# Altium project Test PCB Rev 1.PrjPcb
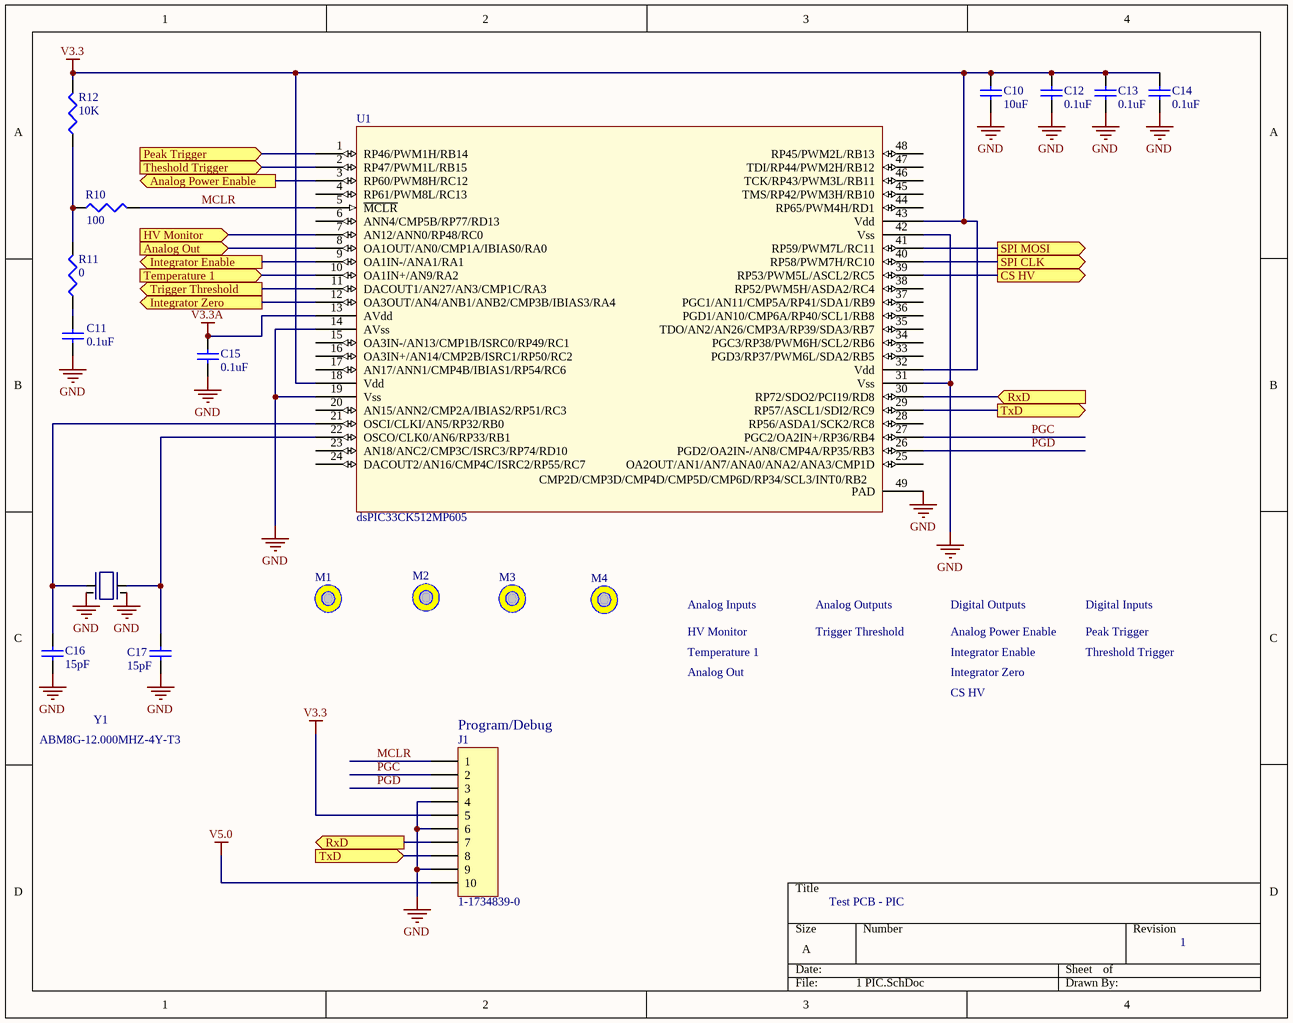
[diagram p0: 1 PIC.SchDoc]
6 sheets, 158 parts. Net scope: flat (ports and power ports of the same name join across sheets).
Board file: Test PCB Rev 1.PcbDoc
Sheets:
  1 PIC.SchDoc
  2 Analog.SchDoc
  3 Bias Supply.SchDoc
  4 USB.SchDoc
  5 SiPM.SchDoc
  6 Power.SchDoc

## Sheet 1 PIC.SchDoc
size A

### Parts
C10  10uF  [C0805]
C11  0.1uF  [C0402]
C12  0.1uF  [C0402]
C13  0.1uF  [C0402]
C14  0.1uF  [C0402]
C15  0.1uF  [C0402]
C16  15pF  [C0603]
C17  15pF  [C0603]
J1  1-1734839-0  [1-1734839-0]
M1  Mounting Hole  [Mounting Hole 0-80]  (value not drawn)
M2  Mounting Hole  [Mounting Hole 0-80]  (value not drawn)
M3  Mounting Hole  [Mounting Hole 0-80]  (value not drawn)
M4  Mounting Hole  [Mounting Hole 0-80]  (value not drawn)
R10  100  [R0603]
R11  0  [R0603]
R12  10K  [R0603]
U1  dsPIC33CK512MP605  [QFN40P600X600X90_HS-49N]
Y1  ABM8G-12.000MHZ-4Y-T3  [7M Series XTAL]

### Ports
Analog Out (in), Analog Power Enable (out), CS HV (out), HV Monitor (in), Integrator Enable (out), Integrator Zero (out), Peak Trigger (in), RxD (in), RxD (out), SPI CLK (out), SPI MOSI (out), Temperature 1 (in), Theshold Trigger (in), Trigger Threshold (out), TxD (in), TxD (out)

### Nets
GND: C10.1 C11.1 C12.1 C13.1 C14.1 C15.1 C16.1 C17.1 J1.4 J1.6 J1.9 U1.14(AVss) U1.19(Vss) U1.31(Vss) U1.42(Vss) U1.49(PAD) Y1.2 Y1.4
V3.3: C10.2 C12.2 C13.2 C14.2 J1.5 R12.2 U1.18(Vdd) U1.32(Vdd) U1.43(Vdd)
V3.3A: C15.2 U1.13(AVdd)
V5.0: J1.10
Analog Out: U1.8(OA1OUT/AN0/CMP1A/IBIAS0/RA0) ; port Analog Out
MCLR: J1.1 R10.2 U1.5(~{MCLR})
PGC: J1.2 U1.27(PGC2/OA2IN+/RP36/RB4)
PGD: J1.3 U1.26(PGD2/OA2IN-/AN8/CMP4A/RP35/RB3)
NetC11_2: C11.2 R11.1
NetC16_2: C16.2 U1.21(OSCI/CLKI/AN5/RP32/RB0) Y1.1
NetC17_2: C17.2 U1.22(OSCO/CLK0/AN6/RP33/RB1) Y1.3
NetJ1_7: J1.7 U1.30(RP72/SDO2/PCI19/RD8) ; port RxD
NetJ1_8: J1.8 U1.29(RP57/ASCL1/SDI2/RC9) ; port TxD
NetR10_1: R10.1 R11.2 R12.1
NetR80_2: U1.11(DACOUT1/AN27/AN3/CMP1C/RA3) ; port Trigger Threshold
NetR82_1: U1.2(RP47/PWM1L/RB15) ; port Theshold Trigger
NetR94_1: U1.1(RP46/PWM1H/RB14) ; port Peak Trigger
NetU1_3: U1.3(RP60/PWM8H/RC12) ; port Analog Power Enable
NetU1_7: U1.7(AN12/ANN0/RP48/RC0) ; port HV Monitor
NetU1_9: U1.9(OA1IN-/ANA1/RA1) ; port Integrator Enable
NetU1_10: U1.10(OA1IN+/AN9/RA2) ; port Temperature 1
NetU1_12: U1.12(OA3OUT/AN4/ANB1/ANB2/CMP3B/IBIAS3/RA4) ; port Integrator Zero
NetU1_39: U1.39(RP53/PWM5L/ASCL2/RC5) ; port CS HV
NetU1_40: U1.40(RP58/PWM7H/RC10) ; port SPI CLK
NetU1_41: U1.41(RP59/PWM7L/RC11) ; port SPI MOSI

Not connected (* = marked no-connect by the designer): U1 4(RP61/PWM8L/RC13) 6(ANN4/CMP5B/RP77/RD13) 15(OA3IN-/AN13/CMP1B/ISRC0/RP49/RC1) 16(OA3IN+/AN14/CMP2B/ISRC1/RP50/RC2) 17(AN17/ANN1/CMP4B/IBIAS1/RP54/RC6) 20(AN15/ANN2/CMP2A/IBIAS2/RP51/RC3) 23(AN18/ANC2/CMP3C/ISRC3/RP74/RD10) 24(DACOUT2/AN16/CMP4C/ISRC2/RP55/RC7) 25(OA2OUT/AN1/AN7/ANA0/ANA2/ANA3/CMP1D) 28(RP56/ASDA1/SCK2/RC8) 33(PGD3/RP37/PWM6L/SDA2/RB5) 34(PGC3/RP38/PWM6H/SCL2/RB6) 35(TDO/AN2/AN26/CMP3A/RP39/SDA3/RB7) 36(PGD1/AN10/CMP6A/RP40/SCL1/RB8) 37(PGC1/AN11/CMP5A/RP41/SDA1/RB9) 38(RP52/PWM5H/ASDA2/RC4) 44(RP65/PWM4H/RD1) 45(TMS/RP42/PWM3H/RB10) 46(TCK/RP43/PWM3L/RB11) 47(TDI/RP44/PWM2H/RB12) 48(RP45/PWM2L/RB13)

### Notes on the sheet
- Analog Inputs
- HV Monitor
- Analog Outputs
- Trigger Threshold
- Digital Outputs
- Analog Power Enable
- Digital Inputs
- Peak Trigger
- Temperature 1
- Analog Out
- Integrator Enable
- Integrator Zero
- CS HV
- Threshold Trigger
- (near J1) Program/Debug
- Test PCB - PIC
- 1
- (in symbol dsPIC33CK512MP605) CMP2D/CMP3D/CMP4D/CMP5D/CMP6D/RP34/SCL3/INT0/RB2

### Library data of the parts
C10-C17 = Cap SM: Capacitor, SM; Published: 8-Jun-2000; LatestRevisionDate: 29-May-2009; LatestRevisionNote: IPC-7351 Footprint Added.; PackageReference: C1206; Publisher: Altium Limited; PackageDescription: Chip Capacitor
  C10: Value: 10uF
  C11-C15: Value: 0.1uF
  C16 C17: Value: 15pF
J1 = Header 10: LatestRevisionDate: 17-Jul-2002; LatestRevisionNote: Re-released for DXP Platform.; Publisher: Altium Limited; Part Number: 1-1734839-0
R10-R12 = Res SM: Resistor; Published: 8-Jun-2000; LatestRevisionDate: 29-May-2009; LatestRevisionNote: IPC-7351 Footprint Added.; PackageReference: J1-0603; Publisher: Altium Limited; PackageDescription: Chip Resistor
  R10: Value: 100
  R11: Value: 0
  R12: Value: 10K
U1 = dsPIC33CK512MP605: Microcontroller
Y1 = Crystal 4 Terminal

## Sheet 2 Analog.SchDoc
size A
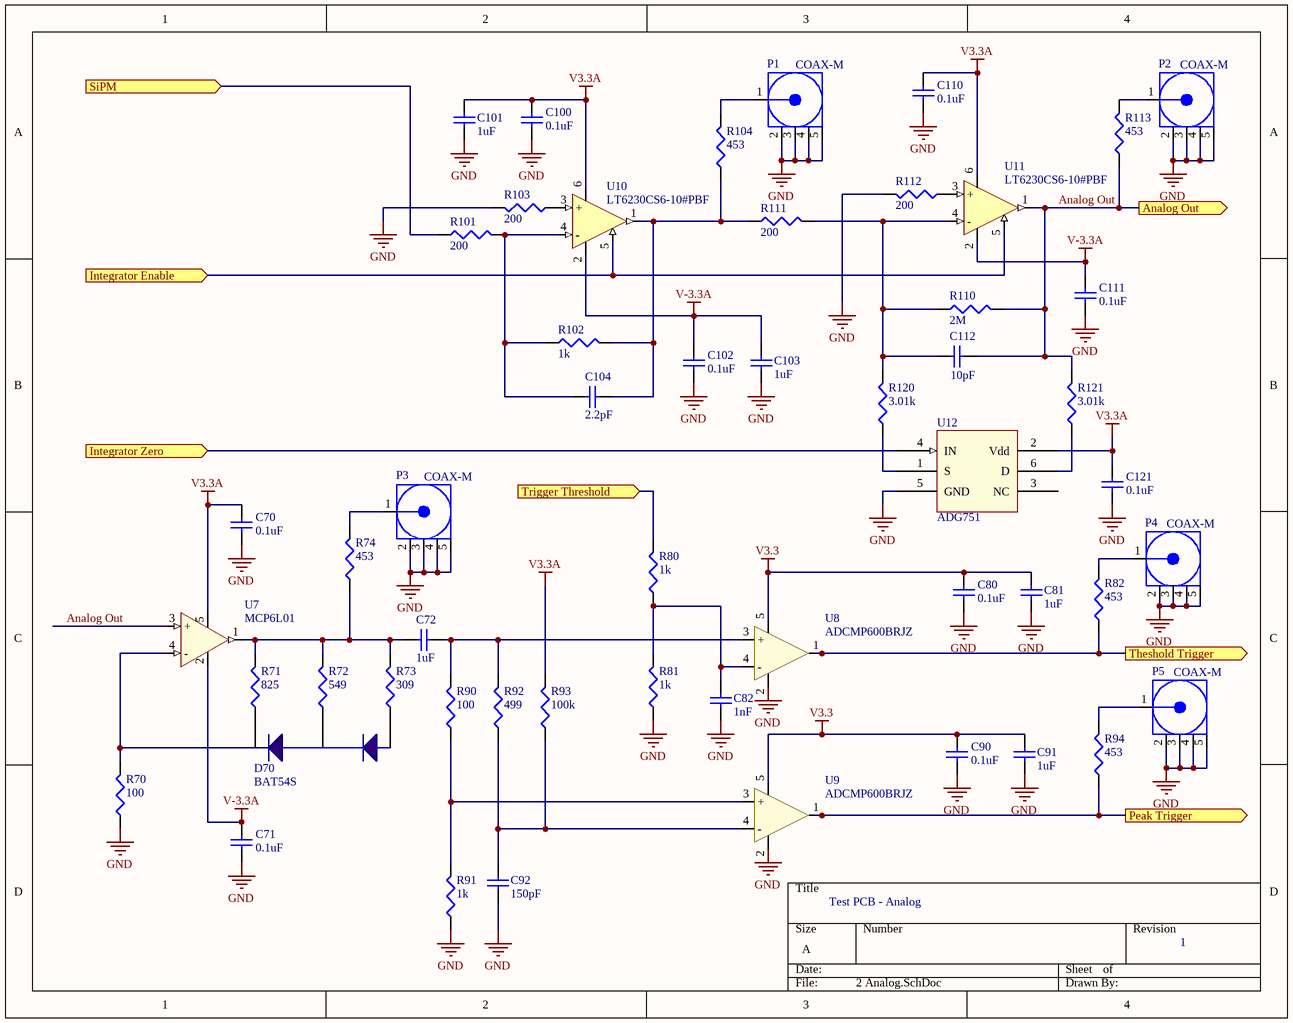
[diagram p1: 2 Analog.SchDoc]

### Parts
C70  0.1uF  [C0402]
C71  0.1uF  [C0402]
C72  1uF  [C0603]
C80  0.1uF  [C0402]
C81  1uF  [C0603]
C82  1nF  [C0603]
C90  0.1uF  [C0402]
C91  1uF  [C0603]
C92  150pF  [C0603]
C100  0.1uF  [C0402]
C101  1uF  [C0603]
C102  0.1uF  [C0402]
C103  1uF  [C0603]
C104  2.2pF  [C0603]
C110  0.1uF  [C0402]
C111  0.1uF  [C0402]
C112  10pF  [C0603]
C121  0.1uF  [C0402]
D70  BAT54S  [SOT323-3]
P1  COAX-M  [MMCX/SM]
P2  COAX-M  [MMCX/SM]
P3  COAX-M  [MMCX/SM]
P4  COAX-M  [MMCX/SM]
P5  COAX-M  [MMCX/SM]
R70  100  [R0603]
R71  825  [R0603]
R72  549  [R0603]
R73  309  [R0603]
R74  453  [R0603]
R80  1k  [R0603]
R81  1k  [R0603]
R82  453  [R0603]
R90  100  [R0603]
R91  1k  [R0603]
R92  499  [R0603]
R93  100k  [R0603]
R94  453  [R0603]
R101  200  [R0603]
R102  1k  [R0603]
R103  200  [R0603]
R104  453  [R0603]
R110  2M  [R0603]
R111  200  [R0603]
R112  200  [R0603]
R113  453  [R0603]
R120  3.01k  [R0603]
R121  3.01k  [R0603]
U7  MCP6L01  [SOT23-5]
U8  ADCMP600BRJZ  [SC70-5]
U9  ADCMP600BRJZ  [SC70-5]
U10  LT6230CS6-10#PBF  [SOT23-6]
U11  LT6230CS6-10#PBF  [SOT23-6]
U12  ADG751  [SOT23-6]

### Ports
Analog Out (out), Integrator Enable (in), Integrator Zero (in), Peak Trigger (out), SiPM (in), Theshold Trigger (out), Trigger Threshold (in)

### Nets
GND: C70.1 C71.1 C80.1 C81.1 C82.1 C90.1 C91.1 C92.1 C100.1 C101.1 C102.1 C103.1 C110.1 C111.1 C121.1 P1.2(GND) P1.3(GND) P1.4(GND) P1.5(GND) P2.2(GND) P2.3(GND) P2.4(GND) P2.5(GND) P3.2(GND) P3.3(GND) P3.4(GND) P3.5(GND) P4.2(GND) P4.3(GND) P4.4(GND) P4.5(GND) P5.2(GND) P5.3(GND) P5.4(GND) P5.5(GND) R70.1 R81.1 R91.1 R103.2 R112.2 U8.2(GND) U9.2(GND) U12.5(GND)
V3.3: C80.2 C81.2 C90.2 C91.2 U8.5(Vcc) U9.5(Vcc)
V3.3A: C70.2 C100.2 C101.2 C110.2 C121.2 R93.2 U7.5(Vdd) U10.6(V+) U11.6(V+) U12.2(Vdd)
V-3.3A: C71.2 C102.2 C103.2 C111.2 U7.2(GND) U10.2(V-) U11.2(V-)
Analog Out: C112.2 R110.2 R113.1 R121.2 U7.3(+) U11.1(Output) ; port Analog Out
NetC72_1: C72.1 R90.2 R92.2 U8.3(+)
NetC72_2: C72.2 R71.2 R72.2 R73.2 R74.1 U7.1(Vout)
NetC82_2: C82.2 R80.1 R81.2 U8.4(-)
NetC92_2: C92.2 R92.1 R93.1 U9.4(-)
NetC104_1: C104.1 R101.2 R102.1 U10.4(-)
NetC104_2: C104.2 R102.2 R104.1 R111.1 U10.1(Output)
NetC112_1: C112.1 R110.1 R111.2 R120.2 U11.4(-)
NetD70_1: D70.1 R73.1
NetD70_2: D70.2 R71.1
NetD70_3: D70.3 R72.1
NetP1_1: P1.1(Signal) R104.2
NetP2_1: P2.1(Signal) R113.2
NetP3_1: P3.1(Signal) R74.2
NetP4_1: P4.1(Signal) R82.2
NetP5_1: P5.1(Signal) R94.2
NetR1_1: R101.1 ; port SiPM
NetR70_2: R70.2 U7.4(-)
NetR80_2: R80.2 ; port Trigger Threshold
NetR82_1: R82.1 U8.1(Q) ; port Theshold Trigger
NetR90_1: R90.1 R91.2 U9.3(+)
NetR94_1: R94.1 U9.1(Q) ; port Peak Trigger
NetR103_1: R103.1 U10.3(+)
NetR112_1: R112.1 U11.3(+)
NetR120_1: R120.1 U12.1(S)
NetR121_1: R121.1 U12.6(D)
NetU1_9: U10.5(/S/D) U11.5(/S/D) ; port Integrator Enable
NetU1_12: U12.4(IN) ; port Integrator Zero

Not connected (* = marked no-connect by the designer): U12 3(NC)

### Notes on the sheet
- Test PCB - Analog
- 1

### Library data of the parts
C70-C72 C80-C82 C90-C92 C100-C104 C110-C112 C121 = Cap SM: Capacitor, SM; Published: 8-Jun-2000; LatestRevisionDate: 29-May-2009; LatestRevisionNote: IPC-7351 Footprint Added.; PackageReference: C1206; Publisher: Altium Limited; PackageDescription: Chip Capacitor
  C70 C71 C80 C90 C100 C102 C110 C111 C121: Value: 0.1uF
  C72 C81 C91 C101 C103: Value: 1uF
  C82: Value: 1nF
  C92: Value: 150pF
  C104: Value: 2.2pF
  C112: Value: 10pF
P1-P5 = COAX-M: RF Coaxial PCB Connector, MMCX; Thru-Hole, Vertical Mount Plug,  50 Ohm Impedance; PackageDocument: Rev. A, 16-Jun-1997; PCB_Layout: Complies with manufacturer's recommendation.; DrillSize: Corresponds to nominal value.; Published: 15-Jul-2004; LatestRevisionDate: 15-Jul-2004; LatestRevisionNote: Component Replaced.; DatasheetDocument: 30-May-2003; PackageReference: 908-21103; Publisher: Altium Limited; ComponentLink1Description: Manufacturer Link; ComponentLink1URL: http://www.amphenolrf.com/
R70-R74 R80-R82 R90-R94 R101-R104 R110-R113 R120 R121 = Res SM: Resistor; Published: 8-Jun-2000; LatestRevisionDate: 29-May-2009; LatestRevisionNote: IPC-7351 Footprint Added.; PackageReference: J1-0603; Publisher: Altium Limited; PackageDescription: Chip Resistor
  R70 R90: Value: 100
  R71: Value: 825
  R72: Value: 549
  R73: Value: 309
  R74 R82 R94 R104 R113: Value: 453
  R80 R81 R91 R102: Value: 1k
  R92: Value: 499
  R93: Value: 100k
  R101 R103 R111 R112: Value: 200
  R110: Value: 2M
  R120 R121: Value: 3.01k
U7 = MCP6L01: Op amp RRIO
U8 U9 = ADCMP600: Comparator
U10 U11 = LMH6639: Op amp, RRO

## Sheet 3 Bias Supply.SchDoc
size A
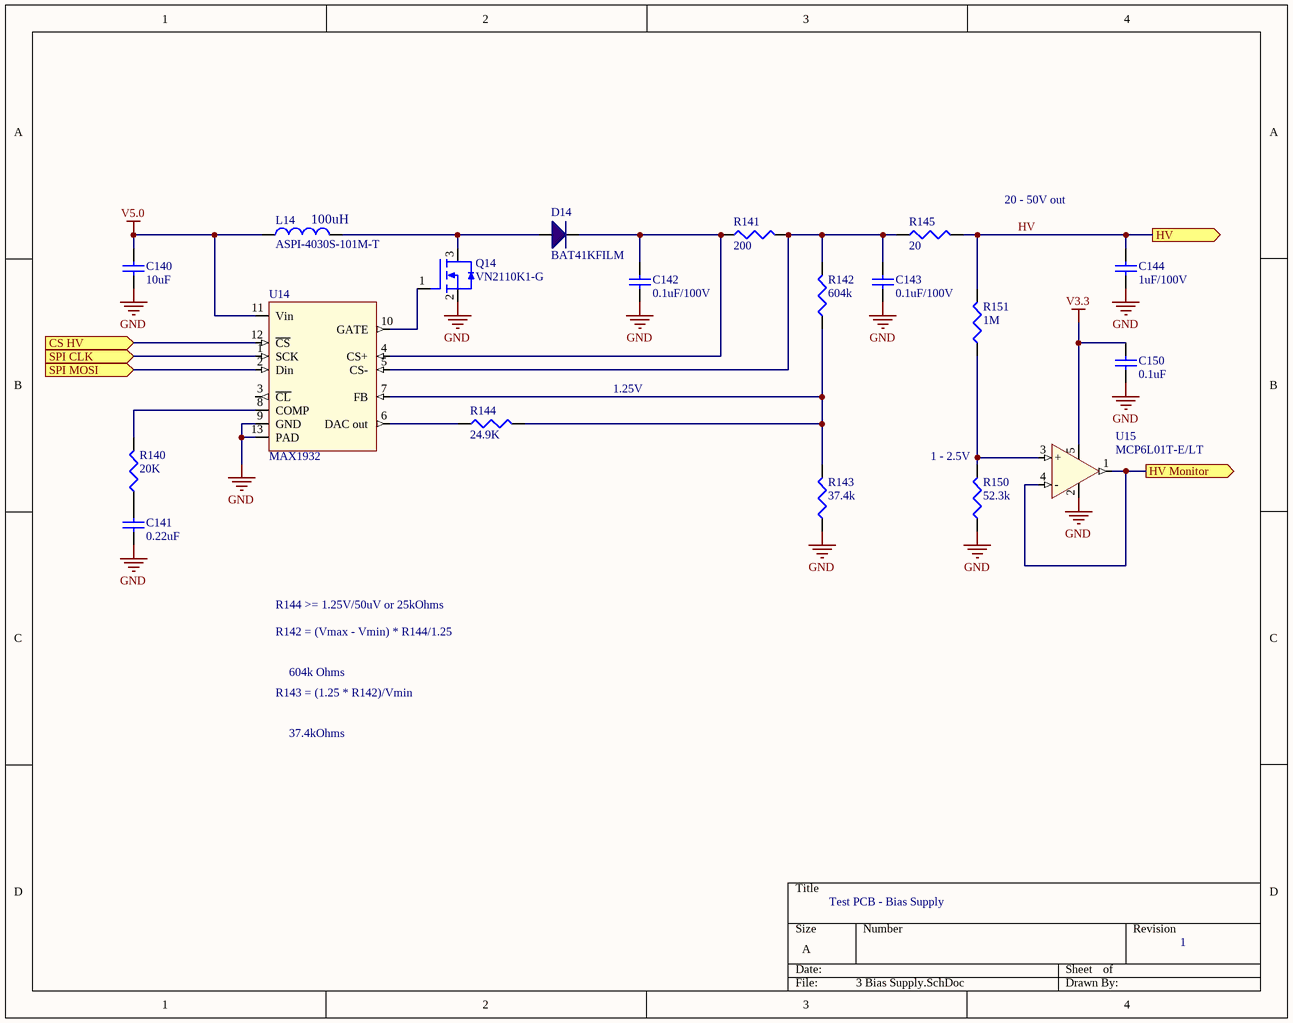
[diagram p2: 3 Bias Supply.SchDoc]

### Parts
C140  10uF  [C0805]
C141  0.22uF  [C0603]
C142  0.1uF/100V  [C0603]
C143  0.1uF/100V  [C0603]
C144  1uF/100V  [C0805]
C150  0.1uF  [C0402]
D14  BAT41KFILM  [SOD523]
L14  ASPI-4030S-101M-T  Inductance: 100uH  [L_4018]
Q14  VN2110K1-G  [SOT23-3]
R140  20K  [R0603]
R141  200  [R0603]
R142  604k  [R0603]
R143  37.4k  [R0603]
R144  24.9K  [R0603]
R145  20  [R0603]
R150  52.3k  [R0603]
R151  1M  [R0603]
U14  MAX1932  [QFN127P600-12N]
U15  MCP6L01T-E/LT  [SOT23-5]

### Ports
CS HV (in), HV (out), HV Monitor (out), SPI CLK (in), SPI MOSI (in)

### Nets
GND: C140.1 C141.1 C142.1 C143.1 C144.1 C150.1 Q14.2 R143.1 R150.1 U14.9(GND) U14.13(PAD) U15.2(GND)
V3.3: C150.2 U15.5(Vdd)
V5.0: C140.2 L14.1 U14.11(Vin)
HV: C144.2 R145.2 R151.2 ; port HV
NetC141_2: C141.2 R140.1
NetC142_2: C142.2 D14.2(K) R141.1 U14.4(CS+)
NetC143_2: C143.2 R141.2 R142.2 R145.1 U14.5(CS-)
NetD14_1: D14.1(A) L14.2 Q14.3
NetQ14_1: Q14.1 U14.10(GATE)
NetR140_2: R140.2 U14.8(COMP)
NetR142_1: R142.1 R143.2 R144.2 U14.7(FB)
NetR144_1: R144.1 U14.6(DAC_out)
NetR150_2: R150.2 R151.1 U15.3(+)
NetU1_7: U15.1(Vout) U15.4(-) ; port HV Monitor
NetU1_39: U14.12(~{CS}) ; port CS HV
NetU1_40: U14.1(SCK) ; port SPI CLK
NetU1_41: U14.2(Din) ; port SPI MOSI

Not connected (* = marked no-connect by the designer): U14 3(~{CL})

### Notes on the sheet
- 20 - 50V out
- 1.25V
- (near R150) 1 - 2.5V
- R144 >= 1.25V/50uV or 25kOhms
- R142 = (Vmax - Vmin) * R144/1.25
- R143 = (1.25 * R142)/Vmin
- 604k Ohms
- 37.4kOhms
- Test PCB - Bias Supply
- 1

### Library data of the parts
C140-C144 C150 = Cap SM: Capacitor, SM; Published: 8-Jun-2000; LatestRevisionDate: 29-May-2009; LatestRevisionNote: IPC-7351 Footprint Added.; PackageReference: C1206; Publisher: Altium Limited; PackageDescription: Chip Capacitor
  C140: Value: 10uF
  C141: Value: 0.22uF
  C142 C143: Value: 0.1uF/100V
  C144: Value: 1uF/100V
  C150: Value: 0.1uF
D14 = BAT41KFILM: Schottky diode; Part Number: BAT41KFILM
L14 = Inductor: 47uH inductor; Part Number: ASPI-4030S-101M-T
Q14 = N FET: Part Number: DMN10H220L-7
R140-R145 R150 R151 = Res SM: Resistor; Published: 8-Jun-2000; LatestRevisionDate: 29-May-2009; LatestRevisionNote: IPC-7351 Footprint Added.; PackageReference: J1-0603; Publisher: Altium Limited; PackageDescription: Chip Resistor
  R140: Value: 20K
  R141: Value: 200
  R142: Value: 604k
  R143: Value: 37.4k
  R144: Value: 24.9K
  R145: Value: 20
  R150: Value: 52.3k
  R151: Value: 1M
U14 = MAX1932: APD bias supply; Part Number: MAX1932
U15 = MCP6L01: Op amp RRIO; Part Number: MCP6L01T-E/LT

## Sheet 4 USB.SchDoc
size A
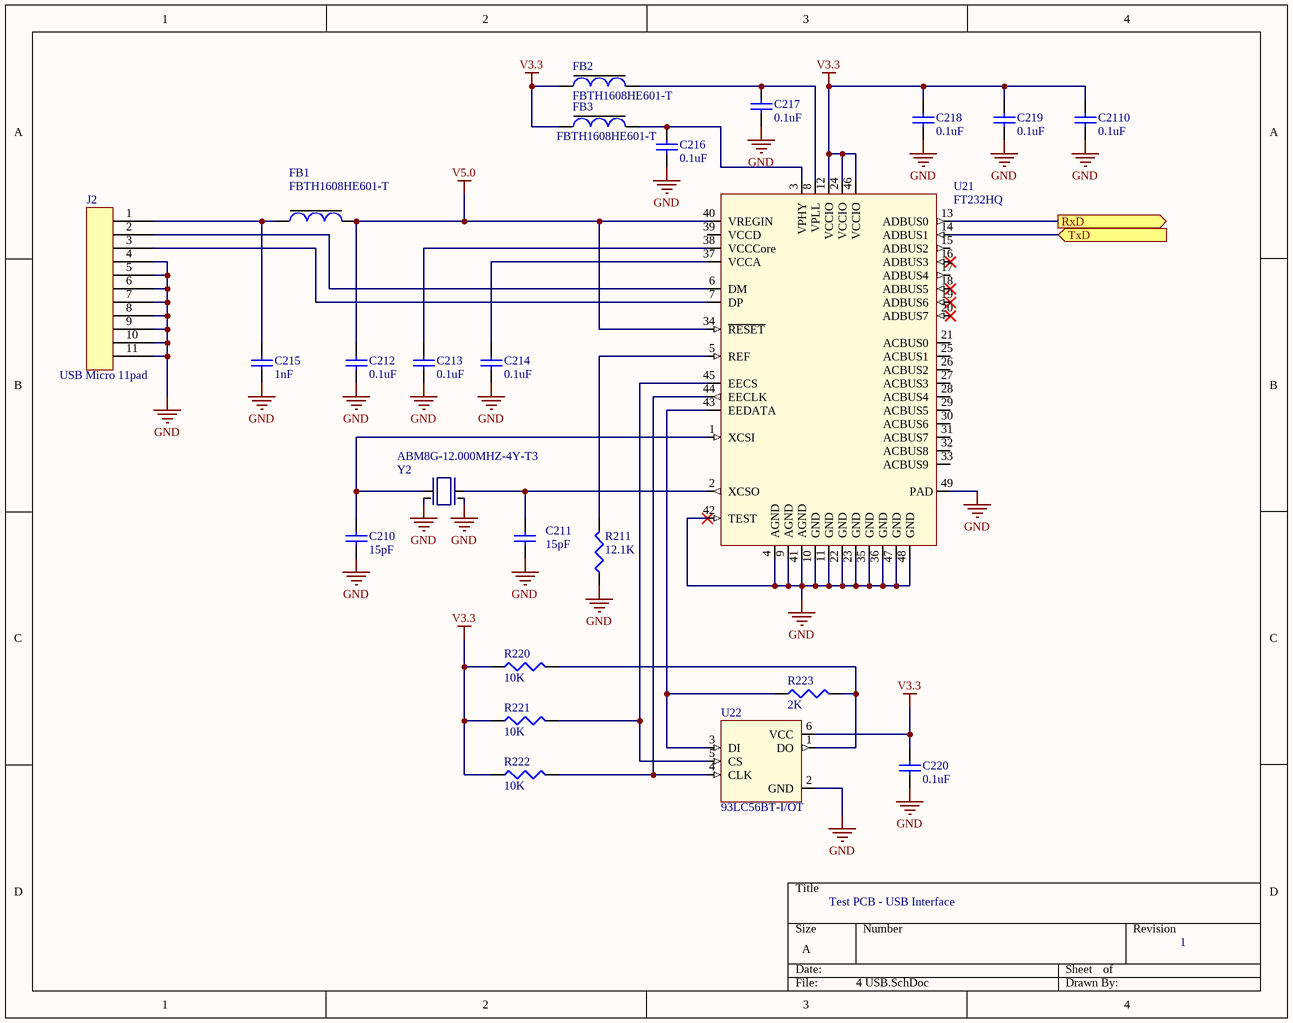
[diagram p3: 4 USB.SchDoc]

### Parts
C210  15pF  [C0603]
C211  15pF  [C0603]
C212  0.1uF  [C0402]
C213  0.1uF  [C0402]
C214  0.1uF  [C0402]
C215  1nF  [C0603]
C216  0.1uF  [C0402]
C217  0.1uF  [C0402]
C218  0.1uF  [C0402]
C219  0.1uF  [C0402]
C220  0.1uF  [C0402]
C2110  0.1uF  [C0402]
FB1  FBTH1608HE601-T  [MPZ1608]
FB2  FBTH1608HE601-T  [MPZ1608]
FB3  FBTH1608HE601-T  [MPZ1608]
J2  USB Micro 11pad  [FCI 10118193]
R211  12.1K  [R0603]
R220  10K  [R0603]
R221  10K  [R0603]
R222  10K  [R0603]
R223  2K  [R0603]
U21  FT232HQ  [QFN50P800X800X100_HS-49N]
U22  93LC56BT-I/OT  [SOT23-6]
Y2  ABM8G-12.000MHZ-4Y-T3  [7M Series XTAL]

### Ports
RxD (out), TxD (in)

### Nets
GND: C210.1 C211.1 C212.1 C213.1 C214.1 C215.1 C216.1 C217.1 C218.1 C219.1 C220.1 C2110.1 J2.4 J2.5 J2.6 J2.7 J2.8 J2.9 J2.10 J2.11 R211.1 U21.4(AGND) U21.9(AGND) U21.10(GND) U21.11(GND) U21.22(GND) U21.23(GND) U21.35(GND) U21.36(GND) U21.41(AGND) U21.42(TEST) U21.47(GND) U21.48(GND) U21.49(PAD) U22.2(GND) Y2.2 Y2.4
V3.3: C218.2 C219.2 C220.2 C2110.2 FB2.1 FB3.1 R220.1 R221.1 R222.1 U21.12(VCCIO) U21.24(VCCIO) U21.46(VCCIO) U22.6(VCC)
V5.0: C212.2 FB1.2 U21.34(~{RESET}) U21.40(VREGIN)
NetC210_2: C210.2 U21.1(XCSI) Y2.1
NetC211_2: C211.2 U21.2(XCSO) Y2.3
NetC213_2: C213.2 U21.38(VCCCore)
NetC214_2: C214.2 U21.37(VCCA)
NetC215_2: C215.2 FB1.1 J2.1
NetC216_2: C216.2 FB3.2 U21.3(VPHY)
NetC217_2: C217.2 FB2.2 U21.8(VPLL)
NetJ1_7: U21.13(ADBUS0) ; port RxD
NetJ1_8: U21.14(ADBUS1) ; port TxD
NetJ2_2: J2.2 U21.6(DM)
NetJ2_3: J2.3 U21.7(DP)
NetR211_2: R211.2 U21.5(REF)
NetR220_2: R220.2 R223.2 U22.1(DO)
NetR221_2: R221.2 U21.45(EECS) U22.5(CS)
NetR222_2: R222.2 U21.44(EECLK) U22.4(CLK)
NetR223_1: R223.1 U21.43(EEDATA) U22.3(DI)

Not connected (* = marked no-connect by the designer): U21 15(ADBUS2) 16(ADBUS3)* 17(ADBUS4) 18(ADBUS5)* 19(ADBUS6)* 20(ADBUS7)* 21(ACBUS0) 25(ACBUS1) 26(ACBUS2) 27(ACBUS3) 28(ACBUS4) 29(ACBUS5) 30(ACBUS6) 31(ACBUS7) 32(ACBUS8) 33(ACBUS9) 39(VCCD)

### Notes on the sheet
- Test PCB - USB Interface
- 1

### Library data of the parts
C210-C220 C2110 = Cap SM: Capacitor, SM; Published: 8-Jun-2000; LatestRevisionDate: 29-May-2009; LatestRevisionNote: IPC-7351 Footprint Added.; PackageReference: C1206; Publisher: Altium Limited; PackageDescription: Chip Capacitor
  C210 C211: Value: 15pF
  C212-C214 C216-C220 C2110: Value: 0.1uF
  C215: Value: 1nF
FB1-FB3 = Ferrite Bead
R211 R220-R223 = Res SM: Resistor; Published: 8-Jun-2000; LatestRevisionDate: 29-May-2009; LatestRevisionNote: IPC-7351 Footprint Added.; PackageReference: J1-0603; Publisher: Altium Limited; PackageDescription: Chip Resistor
  R211: Value: 12.1K
  R220-R222: Value: 10K
  R223: Value: 2K
U21 = FT232HQ: USB interface
Y2 = Crystal 4 Terminal

## Sheet 5 SiPM.SchDoc
size A
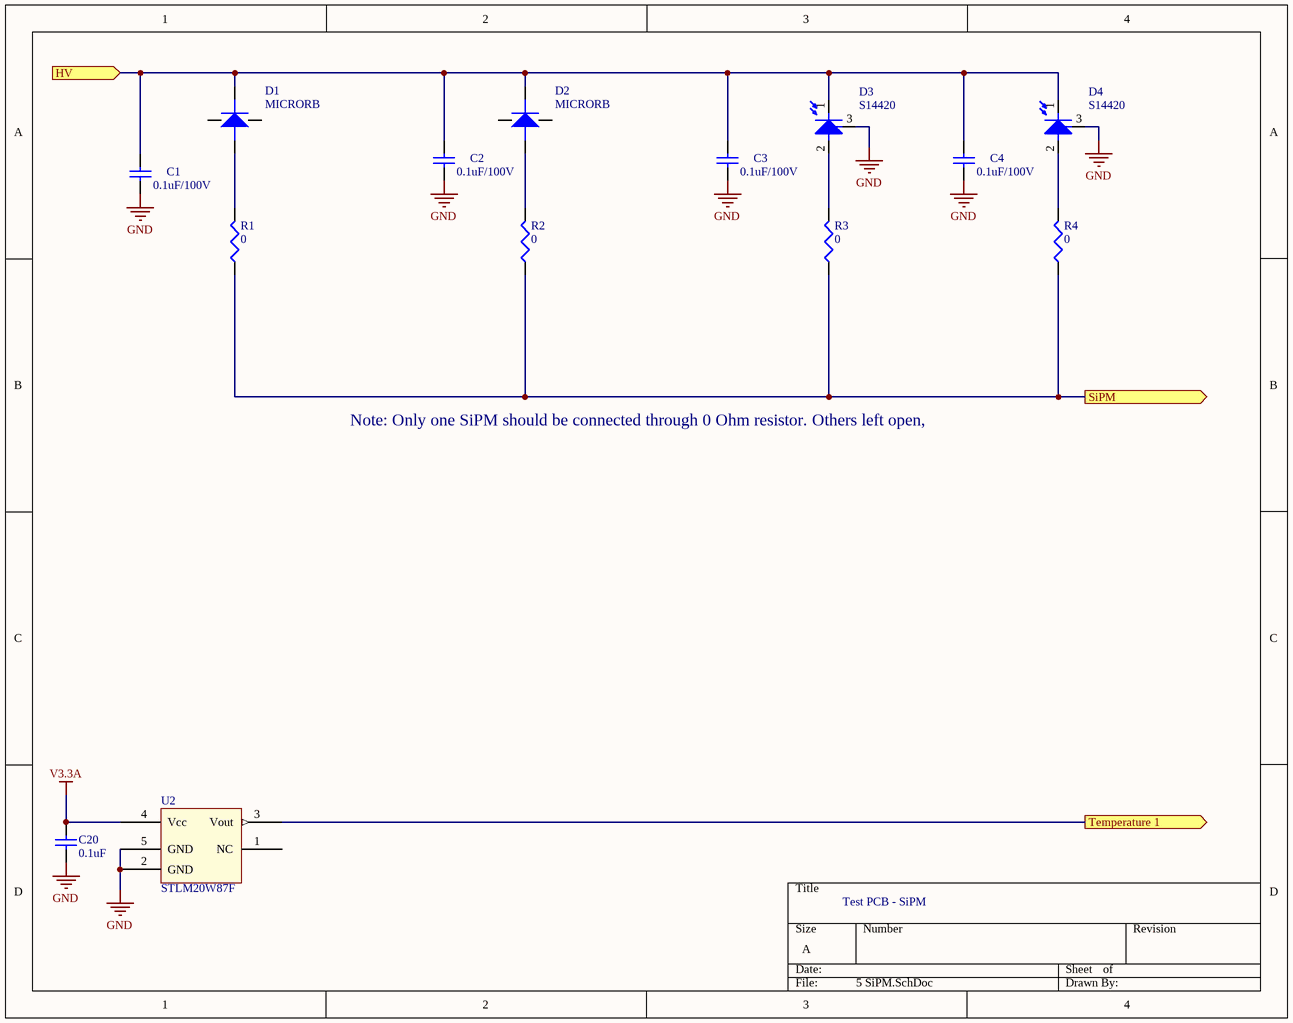
[diagram p4: 5 SiPM.SchDoc]

### Parts
C1  0.1uF/100V  [C0603]
C2  0.1uF/100V  [C0603]
C3  0.1uF/100V  [C0603]
C4  0.1uF/100V  [C0603]
C20  0.1uF  [C0402]
D1  MICRORB  [MICRORB]
D2  MICRORB  [MICRORB]
D3  S14420  [Photodiode 3pin 200mil]
D4  S14420  [Photodiode 3pin 200mil]
R1  0  [R0603]
R2  0  [R0603]
R3  0  [R0603]
R4  0  [R0603]
U2  STLM20W87F  [SOT323-5]

### Ports
HV (in), SiPM (out), Temperature 1 (out)

### Nets
GND: C1.1 C2.1 C3.1 C4.1 C20.1 D3.3(GND) D4.3(GND) U2.2(GND) U2.5(GND)
V3.3A: C20.2 U2.4(Vcc)
HV: C1.2 C2.2 C3.2 C4.2 D1.3(Cathode) D2.3(Cathode) D3.1(K) D4.1(K) ; port HV
NetD1_1: D1.1(Anode) R1.2
NetD2_1: D2.1(Anode) R2.2
NetD3_2: D3.2(A) R3.2
NetD4_2: D4.2(A) R4.2
NetR1_1: R1.1 R2.1 R3.1 R4.1 ; port SiPM
NetU1_10: U2.3(Vout) ; port Temperature 1

Not connected (* = marked no-connect by the designer): D1 2(Fast_output) 4(NC); D2 2(Fast_output) 4(NC); U2 1(NC)

### Notes on the sheet
- Note: Only one SiPM should be connected through 0 Ohm resistor. Others left open,
- Test PCB - SiPM

### Library data of the parts
C1-C4 C20 = Cap SM: Capacitor, SM; Published: 8-Jun-2000; LatestRevisionDate: 29-May-2009; LatestRevisionNote: IPC-7351 Footprint Added.; PackageReference: C1206; Publisher: Altium Limited; PackageDescription: Chip Capacitor
  C1-C4: Value: 0.1uF/100V
  C20: Value: 0.1uF
D1 D2 = MICRORB: SiPM
R1-R4 = Res SM: Resistor; Published: 8-Jun-2000; LatestRevisionDate: 29-May-2009; LatestRevisionNote: IPC-7351 Footprint Added.; PackageReference: J1-0603; Publisher: Altium Limited; PackageDescription: Chip Resistor; Value: 0
U2 = STML20W87F

## Sheet 6 Power.SchDoc
size A
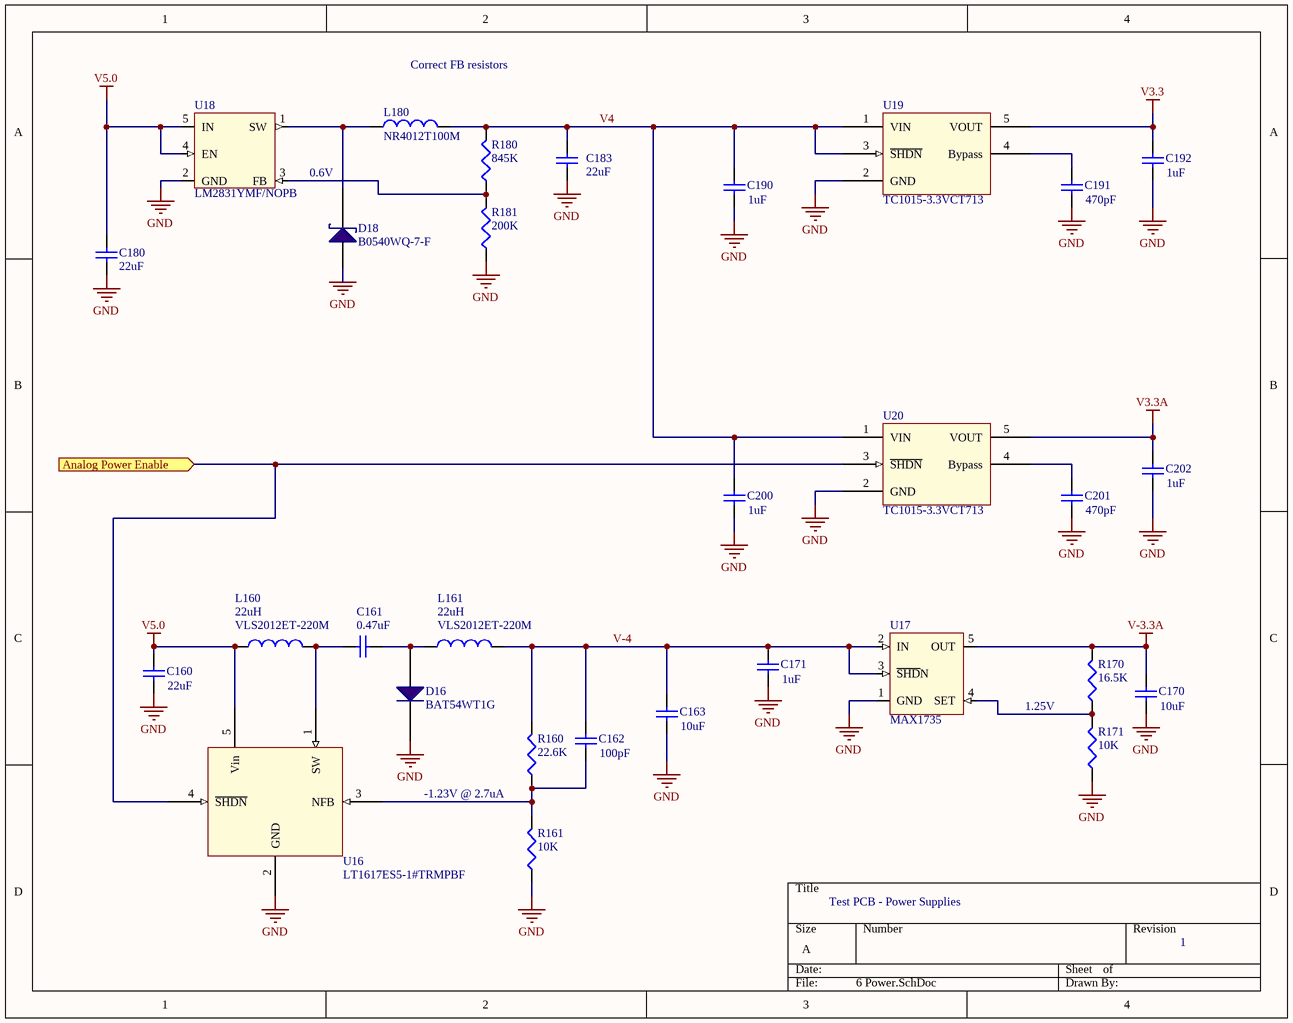
[diagram p5: 6 Power.SchDoc]

### Parts
C160  22uF  [C0805]
C161  0.47uF  [C0603]
C162  100pF  [C0603]
C163  10uF  [C0805]
C170  10uF  [C0805]
C171  1uF  [C0603]
C180  22uF  [C0805]
C183  22uF  [C0805]
C190  1uF  [C0603]
C191  470pF  [C0603]
C192  1uF  [C0603]
C200  1uF  [C0603]
C201  470pF  [C0603]
C202  1uF  [C0603]
D16  BAT54WT1G  [SC70-3]
D18  B0540WQ-7-F  [SOD123W]
L160  VLS2012ET-220M  value 22uH  [L_2012]
L161  VLS2012ET-220M  value 22uH  [L_2012]
L180  NR4012T100M  [L_4018]
R160  22.6K  [R0603]
R161  10K  [R0603]
R170  16.5K  [R0603]
R171  10K  [R0603]
R180  845K  [R0603]
R181  200K  [R0603]
U16  LT1617ES5-1#TRMPBF  [SOT23-5]
U17  MAX1735  [SOT23-5]
U18  LM2831YMF/NOPB  [SOT23-5]
U19  TC1015-3.3VCT713  [SOT23-5]
U20  TC1015-3.3VCT713  [SOT23-5]

### Ports
Analog Power Enable (in)

### Nets
GND: C160.1 C163.1 C170.1 C171.1 C180.1 C183.1 C190.1 C191.1 C192.1 C200.1 C201.1 C202.1 D16.3 D18.1 R161.1 R171.1 R181.1 U16.2(GND) U17.1(GND) U18.2(GND) U19.2(GND) U20.2(GND)
V3.3: C192.2 U19.5(VOUT)
V3.3A: C202.2 U20.5(VOUT)
V5.0: C160.2 C180.2 L160.1 U16.5(Vin) U18.4(EN) U18.5(IN)
V-3.3A: C170.2 R170.2 U17.5(OUT)
V4: C183.2 C190.2 C200.2 L180.2 R180.2 U19.1(VIN) U19.3(~{SHDN}) U20.1(VIN)
V-4: C162.2 C163.2 C171.2 L161.2 R160.2 U17.2(IN) U17.3(~{SHD}N)
NetC161_1: C161.1 L160.2 U16.1(SW)
NetC161_2: C161.2 D16.1 L161.1
NetC162_1: C162.1 R160.1 R161.2 U16.3(NFB)
NetC191_2: C191.2 U19.4(Bypass)
NetC201_2: C201.2 U20.4(Bypass)
NetD18_2: D18.2 L180.1 U18.1(SW)
NetR170_1: R170.1 R171.2 U17.4(SET)
NetR180_1: R180.1 R181.2 U18.3(FB)
NetU1_3: U16.4(~{SHDN}) U20.3(~{SHDN}) ; port Analog Power Enable

### Notes on the sheet
- Correct FB resistors
- 0.6V
- 1.25V
- -1.23V @ 2.7uA
- Test PCB - Power Supplies
- 1

### Library data of the parts
C160-C163 C170 C171 C180 C183 C190-C192 C200-C202 = Cap SM: Capacitor, SM; Published: 8-Jun-2000; LatestRevisionDate: 29-May-2009; LatestRevisionNote: IPC-7351 Footprint Added.; PackageReference: C1206; Publisher: Altium Limited; PackageDescription: Chip Capacitor
  C160 C180 C183: Value: 22uF
  C161: Value: 0.47uF
  C162: Value: 100pF
  C163 C170: Value: 10uF
  C171 C190 C192 C200 C202: Value: 1uF
  C191 C201: Value: 470pF
D16 = BAT54W
D18 = BAT46W: Schottky diode
L160 L161 L180 = Inductor
R160 R161 R170 R171 R180 R181 = Res SM: Resistor; Published: 8-Jun-2000; LatestRevisionDate: 29-May-2009; LatestRevisionNote: IPC-7351 Footprint Added.; PackageReference: J1-0603; Publisher: Altium Limited; PackageDescription: Chip Resistor
  R160: Value: 22.6K
  R161 R171: Value: 10K
  R170: Value: 16.5K
  R180: Value: 845K
  R181: Value: 200K
U16 = LT1617-1
U18 = LM2831
U19 U20 = TC1014

## Nets that join several sheets
GND: 1 PIC (18 pins), 2 Analog (43 pins), 3 Bias Supply (12 pins), 4 USB (37 pins), 5 SiPM (9 pins), 6 Power (22 pins)
V3.3: 1 PIC (9 pins), 2 Analog (6 pins), 3 Bias Supply (C150.2 U15.5), 4 USB (13 pins), 6 Power (C192.2 U19.5)
V3.3A: 1 PIC (C15.2 U1.13), 2 Analog (10 pins), 5 SiPM (C20.2 U2.4), 6 Power (C202.2 U20.5)
V5.0: 1 PIC (J1.10), 3 Bias Supply (C140.2 L14.1 U14.11), 4 USB (C212.2 FB1.2 U21.34 U21.40), 6 Power (6 pins)
V-3.3A: 2 Analog (7 pins), 6 Power (C170.2 R170.2 U17.5)
Analog Out: 1 PIC (U1.8), 2 Analog (6 pins)
HV: 3 Bias Supply (C144.2 R145.2 R151.2), 5 SiPM (8 pins)
NetJ1_7: 1 PIC (J1.7 U1.30), 4 USB (U21.13)
NetJ1_8: 1 PIC (J1.8 U1.29), 4 USB (U21.14)
NetR1_1: 2 Analog (R101.1), 5 SiPM (R1.1 R2.1 R3.1 R4.1)
NetR80_2: 1 PIC (U1.11), 2 Analog (R80.2)
NetR82_1: 1 PIC (U1.2), 2 Analog (R82.1 U8.1)
NetR94_1: 1 PIC (U1.1), 2 Analog (R94.1 U9.1)
NetU1_3: 1 PIC (U1.3), 6 Power (U16.4 U20.3)
NetU1_7: 1 PIC (U1.7), 3 Bias Supply (U15.1 U15.4)
NetU1_9: 1 PIC (U1.9), 2 Analog (U10.5 U11.5)
NetU1_10: 1 PIC (U1.10), 5 SiPM (U2.3)
NetU1_12: 1 PIC (U1.12), 2 Analog (U12.4)
NetU1_39: 1 PIC (U1.39), 3 Bias Supply (U14.12)
NetU1_40: 1 PIC (U1.40), 3 Bias Supply (U14.1)
NetU1_41: 1 PIC (U1.41), 3 Bias Supply (U14.2)